# Altium schematic sheet Main.SchDoc
size A4; SheetNumber: 1; SheetTotal: 5
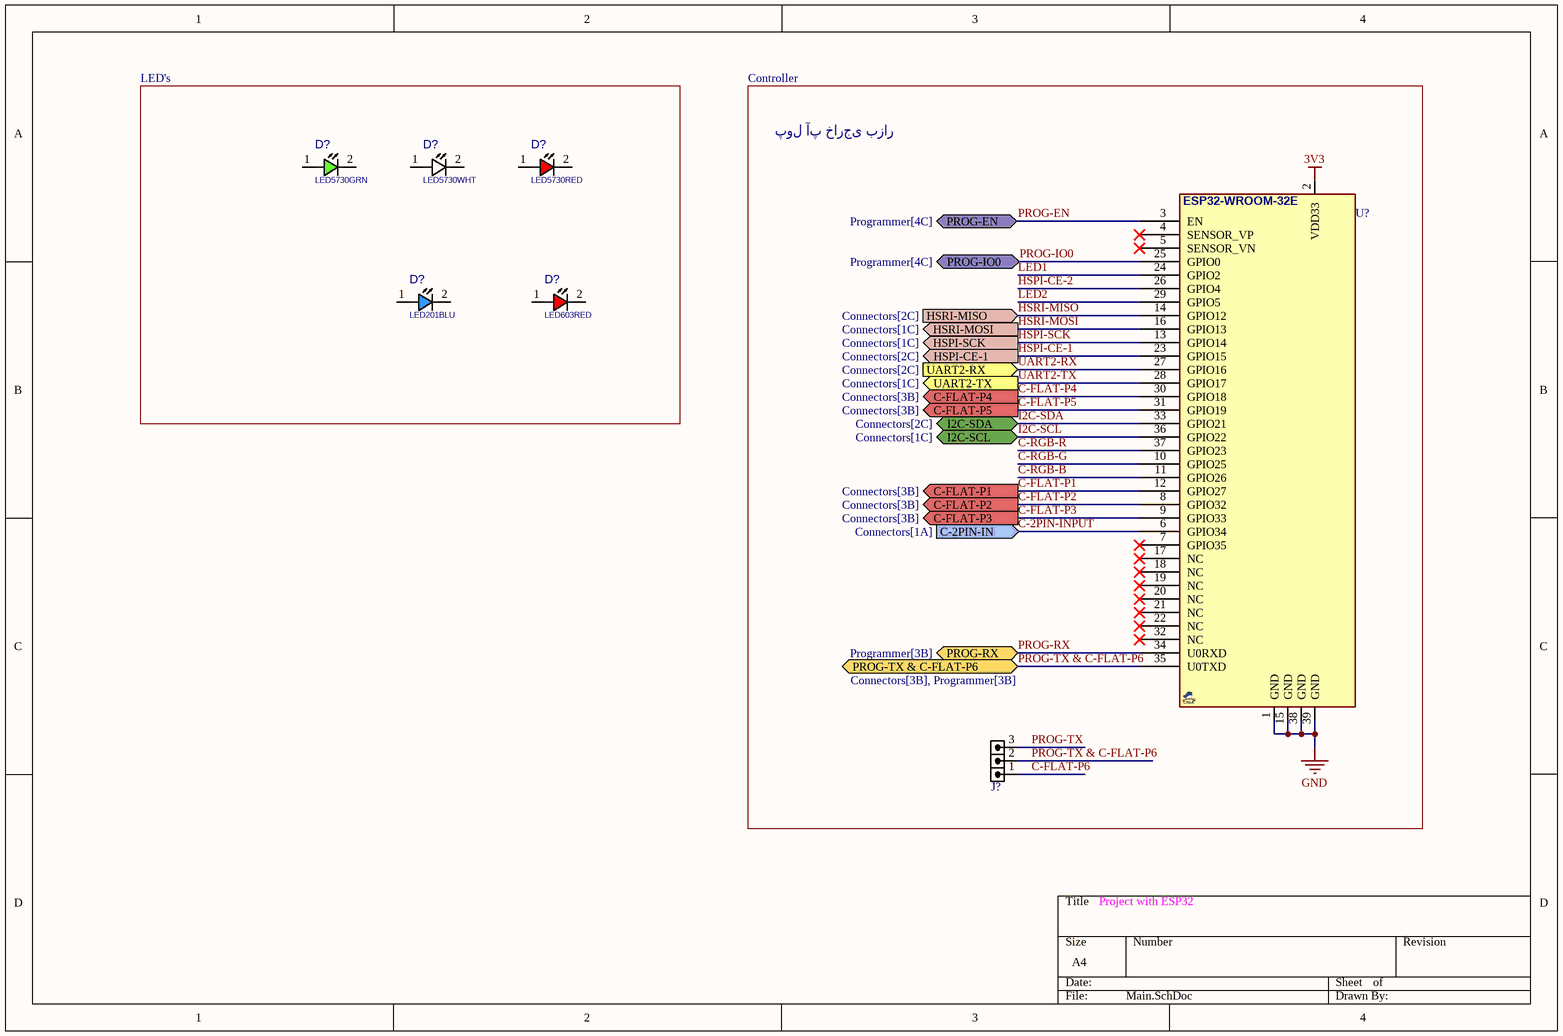
[diagram p0: Main.SchDoc]

## Parts
(Parts that share a designator on the sheet are numbered #1, #2 ... from top to bottom, then left to right.)
D?#1  LED5730GRN  [LED5730]
D?#2  LED5730WHT  [LED5730]
D?#3  LED5730RED  [LED5730]
D?#4  LED201BLU  [LED0201BLU]
D?#5  LED603RED  [LED0603RED]
J?  HDRM3  [HDR_M_1X3]  (value not drawn)
U?  ESP32-WROOM-32E  [ESP32S]  (value not drawn)

## Blocks framed on the sheet
LED's: D?#1-D?#5
پول آپ خارجی بزار: J? U?

## Ports
C-2PIN-IN (in, see Connectors[1A]), C-FLAT-P1 (out, see Connectors[3B]), C-FLAT-P2 (out, see Connectors[3B]), C-FLAT-P3 (out, see Connectors[3B]), C-FLAT-P4 (out, see Connectors[3B]), C-FLAT-P5 (out, see Connectors[3B]), HSPI-CE-1 (out, see Connectors[2C]), HSPI-SCK (out, see Connectors[1C]), HSRI-MISO (in, see Connectors[2C]), HSRI-MOSI (out, see Connectors[1C]), I2C-SCL (bidir, see Connectors[1C]), I2C-SDA (bidir, see Connectors[2C]), PROG-EN (bidir, see Programmer[4C]), PROG-IO0 (bidir, see Programmer[4C]), PROG-RX (bidir, see Programmer[3B]), PROG-TX & C-FLAT-P6 (bidir, see Connectors[3B], Programmer[3B]), UART2-RX (in, see Connectors[2C]), UART2-TX (out, see Connectors[1C])

## Nets
3V3: U?.2(VDD33)
GND: U?.1(GND) U?.15(GND) U?.38(GND) U?.39(GND)
C-2PIN-IN: U?.6(GPIO34) ; port C-2PIN-IN
C-FLAT-P1: U?.12(GPIO27) ; port C-FLAT-P1
C-FLAT-P2: U?.8(GPIO32) ; port C-FLAT-P2
C-FLAT-P3: U?.9(GPIO33) ; port C-FLAT-P3
C-FLAT-P4: U?.30(GPIO18) ; port C-FLAT-P4
C-FLAT-P5: U?.31(GPIO19) ; port C-FLAT-P5
C-FLAT-P6: J?.1
C-RGB-B: U?.11(GPIO26)
C-RGB-G: U?.10(GPIO25)
C-RGB-R: U?.37(GPIO23)
HSPI-CE-1: U?.23(GPIO15) ; port HSPI-CE-1
HSPI-CE-2: U?.26(GPIO4)
HSPI-SCK: U?.13(GPIO14) ; port HSPI-SCK
HSRI-MISO: U?.14(GPIO12) ; port HSRI-MISO
HSRI-MOSI: U?.16(GPIO13) ; port HSRI-MOSI
I2C-SCL: U?.36(GPIO22) ; port I2C-SCL
I2C-SDA: U?.33(GPIO21) ; port I2C-SDA
LED1: U?.24(GPIO2)
LED2: U?.29(GPIO5)
PROG-EN: U?.3(EN) ; port PROG-EN
PROG-IO0: U?.25(GPIO0) ; port PROG-IO0
PROG-RX: U?.34(U0RXD) ; port PROG-RX
PROG-TX: J?.3
PROG-TX & C-FLAT-P6: J?.2 U?.35(U0TXD) ; port PROG-TX & C-FLAT-P6
UART2-RX: U?.27(GPIO16) ; port UART2-RX
UART2-TX: U?.28(GPIO17) ; port UART2-TX

Not connected (* = marked no-connect by the designer): D?#1 1(ANODE) 2(CATHODE); D?#2 1(ANODE) 2(CATHODE); D?#3 1(ANODE) 2(CATHODE); D?#4 1(ANODE) 2(CATHODE); D?#5 1(ANODE) 2(CATHODE); U? 4(SENSOR_VP)* 5(SENSOR_VN)* 7(GPIO35)* 17(NC)* 18(NC)* 19(NC)* 20(NC)* 21(NC)* 22(NC)* 32(NC)*

## Notes on the sheet
- Controller
- Project with ESP32
- Labels drawn without touching a wire or pin: C-2PIN-INPUT

## Library data of the parts
D?#1 = LED_SMD_5730GRN: LED, SMD, 5730 GREEN; MANF: CHINA; DESC: DESCRIPTION; MANF_P#: GBG-5730TGKT; PARAM2: 2.2V; ASSEMBLY: ASSEMBLY; PRICE: 50@Javan; VALUE: LED5730GRN
D?#2 = LED_SMD_5730WHT: LED, SMD, 5730 WHITE; DESC: DESCRIPTION; MANF_P#: MANF_PART#; PARAM2: 2.2V; MANF: MANF; ASSEMBLY: ASSEMBLY; PRICE: 50t@Javan; VALUE: LED5730WHT
D?#3 = LED_SMD_5730RED: LED, SMD, 5730 RED; MANF: CHINA; DESC: DESCRIPTION; PARAM2: 2.2V; ASSEMBLY: ASSEMBLY; PRICE: 50@Javan; VALUE: LED5730RED
D?#4 = LED_SMD_0201_BLU: LED, SMD, 0201, BLUE; PARAM: 5mA, 470nm, 110° Angle; MANF: Lumex; DESC: DESCRIPTION; MANF_P#: SML-LX0201USBC-TR; PARAM2: 2.6V, -40~85°C; ASSEMBLY: ASSEMBLY; PRICE: 0.3$; VALUE: LED201BLU
D?#5 = LED_SMD_0603_RED: LED, SMD, 0603, RED; PARAM: 30mA, 640nm; DESC: DESCRIPTION; MANF_P#: MANF_PART#; PARAM2: 1.8~2.5V; MANF: MANF; ASSEMBLY: ASSEMBLY; PRICE: PRICE; VALUE: LED603RED
J? = HDR_M_1X3: CONN, HEADER, Male, pitch: 2.54mm, 3POS; VALUE: HDRM3
U? = ESP32-WROOM-32E: WiFi with Bluetooth 4.0; MANF_P#: ESP32-WROOM-32E; VALUE: ESP32-WROOM-32E